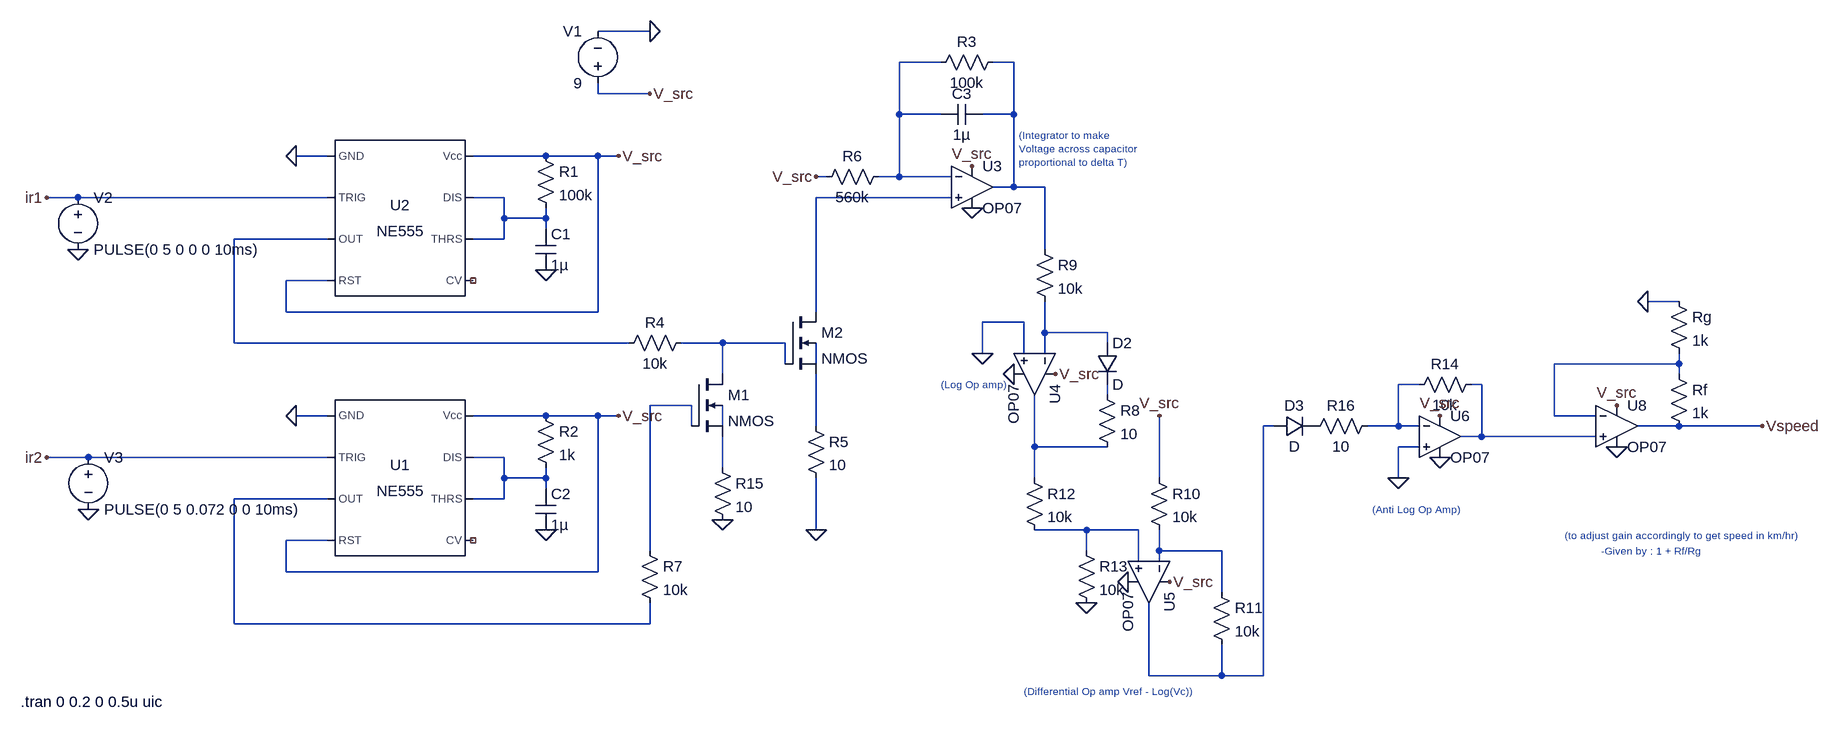
[diagram p0: schematic draft1.asc]
draft1.asc, the LTspice schematic file:
Version 4.1
SHEET 1 2292 680
WIRE 480 -512 400 -512
WIRE 928 -464 864 -464
WIRE 1040 -464 1008 -464
WIRE 400 -416 400 -432
WIRE 480 -416 400 -416
WIRE 864 -384 864 -464
WIRE 928 -384 864 -384
WIRE 1040 -384 1040 -464
WIRE 1040 -384 992 -384
WIRE -16 -320 -64 -320
WIRE 320 -320 208 -320
WIRE 400 -320 320 -320
WIRE 432 -320 400 -320
WIRE 752 -288 736 -288
WIRE 864 -288 864 -384
WIRE 864 -288 832 -288
WIRE 944 -288 864 -288
WIRE 1040 -272 1040 -384
WIRE 1040 -272 1008 -272
WIRE 1088 -272 1040 -272
WIRE -400 -256 -448 -256
WIRE -16 -256 -400 -256
WIRE 256 -256 208 -256
WIRE 944 -256 736 -256
WIRE 256 -224 256 -256
WIRE 320 -224 320 -240
WIRE 320 -224 256 -224
WIRE 320 -208 320 -224
WIRE -16 -192 -160 -192
WIRE 256 -192 256 -224
WIRE 256 -192 208 -192
WIRE 1088 -176 1088 -272
WIRE -16 -128 -80 -128
WIRE 2064 -96 2016 -96
WIRE -80 -80 -80 -128
WIRE 400 -80 400 -320
WIRE 400 -80 -80 -80
WIRE 736 -80 736 -256
WIRE 1056 -64 992 -64
WIRE 1088 -48 1088 -96
WIRE 1184 -48 1088 -48
WIRE -160 -32 -160 -192
WIRE 448 -32 -160 -32
WIRE 592 -32 528 -32
WIRE 688 -32 592 -32
WIRE 1184 -32 1184 -48
WIRE 992 -16 992 -64
WIRE 1056 -16 1056 -64
WIRE 1088 -16 1088 -48
WIRE 688 0 688 -32
WIRE 736 0 736 -32
WIRE 2064 0 2064 -16
WIRE 2064 0 1872 0
WIRE 592 16 592 -32
WIRE 2064 16 2064 0
WIRE 1664 32 1632 32
WIRE 1760 32 1744 32
WIRE 1184 48 1184 32
WIRE 544 64 480 64
WIRE -16 80 -64 80
WIRE 320 80 208 80
WIRE 400 80 320 80
WIRE 432 80 400 80
WIRE 1872 80 1872 0
WIRE 1936 80 1872 80
WIRE 544 96 544 64
WIRE 592 96 592 64
WIRE 736 96 736 16
WIRE 1440 96 1424 96
WIRE 1632 96 1632 32
WIRE 1632 96 1584 96
WIRE 1664 96 1632 96
WIRE 2064 96 2000 96
WIRE 2192 96 2064 96
WIRE 1760 112 1760 32
WIRE 1760 112 1728 112
WIRE 1936 112 1760 112
WIRE 1072 128 1072 48
WIRE 1184 128 1072 128
WIRE 1664 128 1632 128
WIRE -384 144 -448 144
WIRE -16 144 -384 144
WIRE 256 144 208 144
WIRE 592 160 592 112
WIRE 256 176 256 144
WIRE 320 176 320 160
WIRE 320 176 256 176
WIRE 1072 176 1072 128
WIRE 1264 176 1264 80
WIRE 1632 176 1632 128
WIRE 320 192 320 176
WIRE -16 208 -160 208
WIRE 256 208 256 176
WIRE 256 208 208 208
WIRE 736 256 736 176
WIRE 1152 256 1072 256
WIRE 1232 256 1152 256
WIRE -16 272 -80 272
WIRE 480 288 480 64
WIRE 1152 288 1152 256
WIRE 1264 288 1264 256
WIRE 1360 288 1264 288
WIRE 1232 304 1232 256
WIRE 1264 304 1264 288
WIRE -80 320 -80 272
WIRE 400 320 400 80
WIRE 400 320 -80 320
WIRE 1360 352 1360 288
WIRE -160 400 -160 208
WIRE 480 400 480 368
WIRE 480 400 -160 400
WIRE 1248 480 1248 368
WIRE 1360 480 1360 432
WIRE 1360 480 1248 480
WIRE 1424 480 1424 96
WIRE 1424 480 1360 480
FLAG 480 -512 0
FLAG -448 -256 ir1
FLAG -448 144 ir2
FLAG 320 256 0
FLAG 320 -144 0
FLAG -64 -320 0
FLAG -64 80 0
FLAG 736 256 0
FLAG 992 -16 0
FLAG 1152 368 0
FLAG 1632 176 0
FLAG 2192 96 Vspeed
FLAG 592 240 0
FLAG 2016 -96 0
FLAG -400 -176 0
FLAG -384 224 0
FLAG 976 -240 0
FLAG 1040 16 0
FLAG 1216 336 0
FLAG 1696 144 0
FLAG 1968 128 0
FLAG 480 -416 V_src
FLAG 736 -288 V_src
FLAG 432 -320 V_src
FLAG 432 80 V_src
FLAG 1264 80 V_src
FLAG 976 -304 V_src
FLAG 1104 16 V_src
FLAG 1280 336 V_src
FLAG 1696 80 V_src
FLAG 1968 64 V_src
SYMBOL Misc\\NE555 96 176 R0
SYMATTR InstName U1
SYMBOL Misc\\NE555 96 -224 R0
SYMATTR InstName U2
SYMBOL voltage 400 -416 R180
WINDOW 0 24 96 Left 2
WINDOW 3 24 16 Left 2
WINDOW 123 0 0 Left 0
WINDOW 39 0 0 Left 0
SYMATTR InstName V1
SYMATTR Value 9
SYMBOL res 304 -336 R0
SYMATTR InstName R1
SYMATTR Value 100k
SYMBOL res 304 64 R0
SYMATTR InstName R2
SYMATTR Value 1k
SYMBOL cap 304 -208 R0
SYMATTR InstName C1
SYMATTR Value 1µ
SYMBOL cap 304 192 R0
SYMATTR InstName C2
SYMATTR Value 1µ
SYMBOL res 544 -48 R90
WINDOW 0 0 56 VBottom 2
WINDOW 3 32 56 VTop 2
SYMATTR InstName R4
SYMATTR Value 10k
SYMBOL res 720 80 R0
SYMATTR InstName R5
SYMATTR Value 10
SYMBOL res 848 -304 R90
WINDOW 0 0 56 VBottom 2
WINDOW 3 32 56 VTop 2
SYMATTR InstName R6
SYMATTR Value 560k
SYMBOL cap 992 -400 R90
WINDOW 0 0 32 VBottom 2
WINDOW 3 32 32 VTop 2
SYMATTR InstName C3
SYMATTR Value 1µ
SYMBOL res 1072 -192 R0
SYMATTR InstName R9
SYMATTR Value 10k
SYMBOL diode 1168 -32 R0
SYMATTR InstName D2
SYMBOL res 1248 160 R0
SYMATTR InstName R10
SYMATTR Value 10k
SYMBOL res 1344 336 R0
SYMATTR InstName R11
SYMATTR Value 10k
SYMBOL res 1056 160 R0
SYMATTR InstName R12
SYMATTR Value 10k
SYMBOL res 1136 272 R0
SYMATTR InstName R13
SYMATTR Value 10k
SYMBOL diode 1440 112 R270
WINDOW 0 32 32 VTop 2
WINDOW 3 0 32 VBottom 2
SYMATTR InstName D3
SYMBOL res 1760 16 R90
WINDOW 0 0 56 VBottom 2
WINDOW 3 32 56 VTop 2
SYMATTR InstName R14
SYMATTR Value 10k
SYMBOL res 464 272 R0
SYMATTR InstName R7
SYMATTR Value 10k
SYMBOL res 576 144 R0
SYMATTR InstName R15
SYMATTR Value 10
SYMBOL res 2048 0 R0
SYMATTR InstName Rf
SYMATTR Value 1k
SYMBOL res 2048 -112 R0
SYMATTR InstName Rg
SYMATTR Value 1k
SYMBOL res 1168 32 R0
SYMATTR InstName R8
SYMATTR Value 10
SYMBOL res 1488 112 R270
WINDOW 0 32 56 VTop 2
WINDOW 3 0 56 VBottom 2
SYMATTR InstName R16
SYMATTR Value 10
SYMBOL nmos4 544 16 R0
SYMATTR InstName M1
SYMBOL voltage -400 -272 R0
WINDOW 123 0 0 Left 0
WINDOW 39 0 0 Left 0
SYMATTR InstName V2
SYMATTR Value PULSE(0 5 0 0 0 10ms)
SYMBOL voltage -384 128 R0
WINDOW 123 0 0 Left 0
WINDOW 39 0 0 Left 0
SYMATTR InstName V3
SYMATTR Value PULSE(0 5 0.072 0 0 10ms)
SYMBOL nmos4 688 -80 R0
SYMATTR InstName M2
SYMBOL OpAmps\\OP07 1968 32 R0
SYMATTR InstName U8
SYMBOL OpAmps\\OP07 976 -336 R0
SYMATTR InstName U3
SYMBOL OpAmps\\OP07 1136 16 R90
SYMATTR InstName U4
SYMBOL OpAmps\\OP07 1312 336 R90
SYMATTR InstName U5
SYMBOL OpAmps\\OP07 1696 48 R0
SYMATTR InstName U6
SYMBOL res 1024 -480 R90
WINDOW 0 0 56 VBottom 2
WINDOW 3 32 56 VTop 2
SYMATTR InstName R3
SYMATTR Value 100k
TEXT 1048 -352 Left 1 ;(Integrator to make\nVoltage across capacitor\nproportional to delta T)
TEXT 928 32 Left 1 ;(Log Op amp)
TEXT 1056 504 Left 1 ;(Differential Op amp Vref - Log(Vc))
TEXT 1592 224 Left 1 ;(Anti Log Op Amp)
TEXT 1888 264 Left 1 ;(to adjust gain accordingly to get speed in km/hr)
TEXT 1944 288 Left 1 ;-Given by : 1 + Rf/Rg
TEXT -488 520 Left 2 !.tran 0 0.2 0 0.5u uic

The netlist it stands for:
* draft1.asc
X§U1 0 ir2 N020 V_src NC_01 N018 N018 V_src NE555  ; pins GND TRIG OUT RST CV THRS DIS Vcc
X§U2 0 ir1 N005 V_src NC_02 N003 N003 V_src NE555  ; pins GND TRIG OUT RST CV THRS DIS Vcc
V1 V_src 0 9
R1 V_src N003 100k
R2 V_src N018 1k
C1 N003 0 1µ
C2 N018 0 1µ
R4 N007 N005 10k
R5 N015 0 10
R6 N001 V_src 560k
C3 N002 N001 1µ
R9 N002 N006 10k
D2 N006 N012 D
R10 V_src N022 10k
R11 N022 N016 10k
R12 N017 N021 10k
R13 N021 0 10k
D3 N016 P001 D
R14 N011 N010 10k
R7 N013 N020 10k
R15 N019 0 10
Rf N009 Vspeed 1k
Rg 0 N009 1k
R8 N012 N017 10
R16 P001 N010 10
M1 N007 N013 N019 N014 NMOS
V2 ir1 0 PULSE(0 5 0 0 0 10ms)
V3 ir2 0 PULSE(0 5 0.072 0 0 10ms)
M2 N004 N007 N015 N008 NMOS
X§U8 N011 N009 V_src 0 Vspeed LT1001  ; OP07, pins In+ In- V+ V- OUT
X§U3 N004 N001 V_src 0 N002 LT1001  ; OP07, pins In+ In- V+ V- OUT
X§U4 0 N006 V_src 0 N017 LT1001  ; OP07, pins In+ In- V+ V- OUT
X§U5 N021 N022 V_src 0 N016 LT1001  ; OP07, pins In+ In- V+ V- OUT
X§U6 0 N010 V_src 0 N011 LT1001  ; OP07, pins In+ In- V+ V- OUT
R3 N002 N001 100k
.model D D
.lib standard.dio
.model NMOS NMOS
.model PMOS PMOS
.lib standard.mos
* (Integrator to make
* Voltage across capacitor
* proportional to delta T)
* (Log Op amp)
* (Differential Op amp Vref - Log(Vc))
* (Anti Log Op Amp)
* (to adjust gain accordingly to get speed in km/hr)
* -Given by : 1 + Rf/Rg
.tran 0 0.2 0 0.5u uic
.lib NE555.sub
.lib LTC.lib
.backanno
.end